# EAGLE design OSO-MISC-20-023 Trinket SWD Adapter (EAGLE 9.6.2)
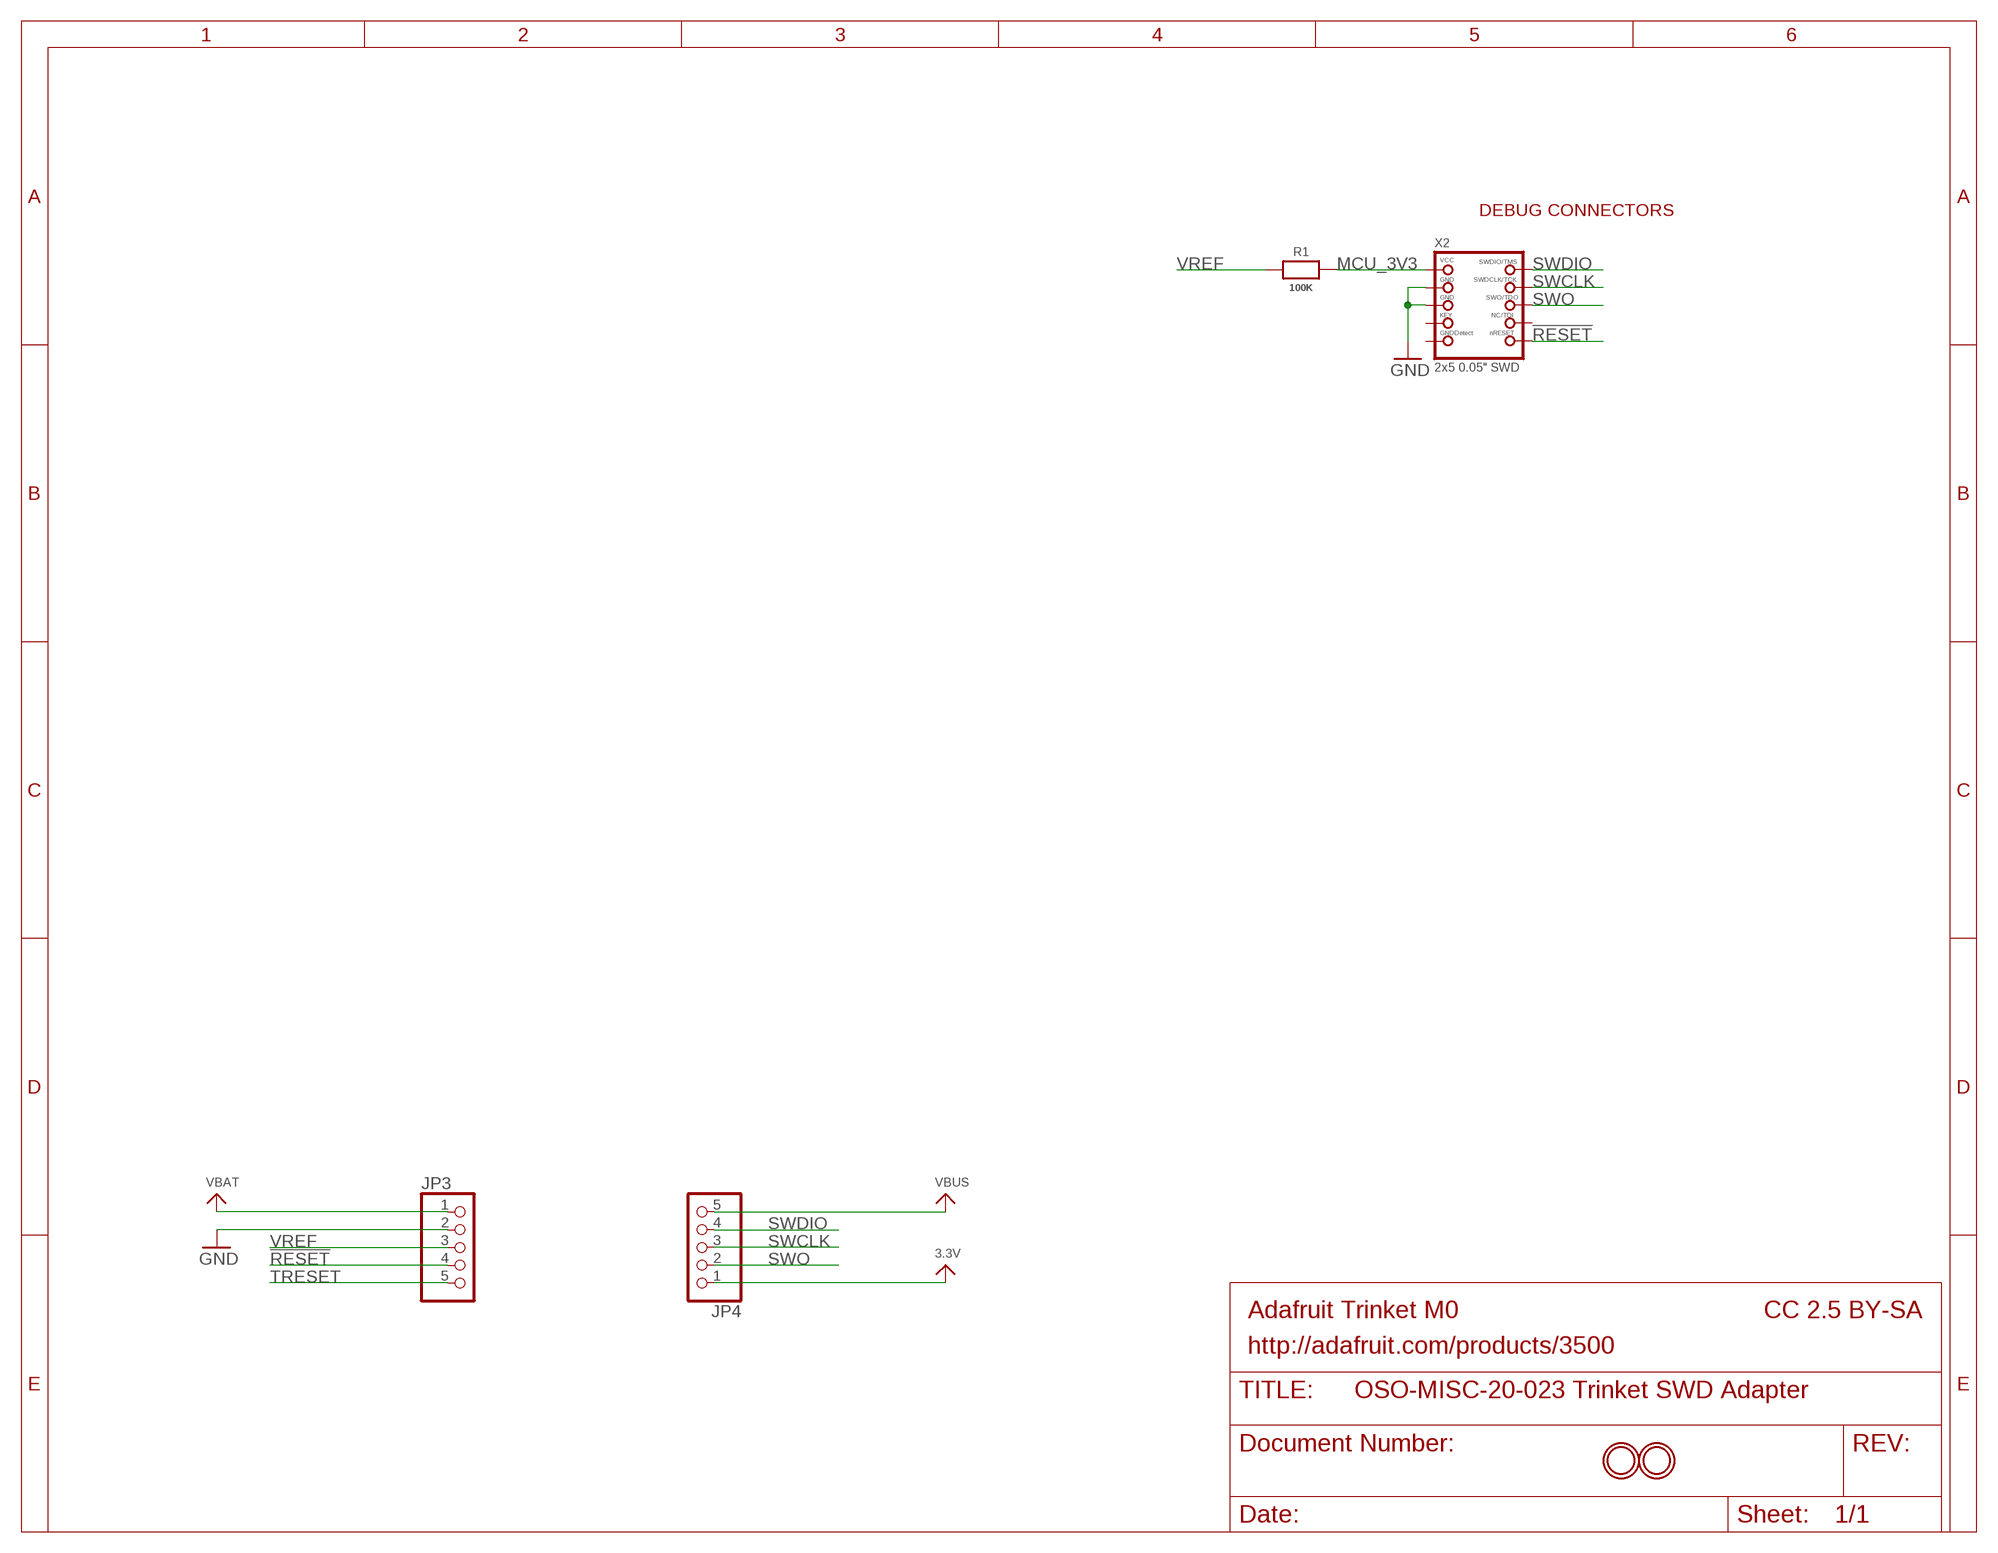
[diagram p0: schematic, sheet 1]

## Parts
JP3  HEADER-1X576MIL  [1X05_ROUND_76]
JP4  HEADER-1X576MIL  [1X05_ROUND_76]
R1  100K  RESISTOR0805_NOOUTLINE  [0805-NO]
U$8  MOUNTINGHOLE2.0  [MOUNTINGHOLE_2.0_PLATED]
U$9  MOUNTINGHOLE2.0  [MOUNTINGHOLE_2.0_PLATED]
X2  2x5 0.05" SWD  JTAG-CORTEXBOXPOSTS  [2X05_1.27MM_BOX_POSTS]

## Nets
3.3V: JP4.1
!RESET: JP3.4 X2.10(NRESET)
GND: JP3.2 X2.3(GND) X2.5(GND)
MCU_3V3 [power]: R1.2 X2.1(VCC)
SWCLK: JP4.3 X2.4(SWDCLK)
SWDIO: JP4.4 X2.2(SWDIO)
SWO: JP4.2 X2.6(SWO)
TRESET: JP3.5
VBAT: JP3.1
VBUS: JP4.5
VREF [power]: JP3.3 R1.1
Unconnected: X2.7(KEY) X2.8(TDI) X2.9(GNDDETECT)

## Notes on the sheet
- DEBUG CONNECTORS
- Adafruit Trinket M0 | CC 2.5 BY-SA
- http://adafruit.com/products/3500

## Library data of the parts
JP3 JP4 = microbuilder:HEADER-1X5: PIN HEADER
R1 = microbuilder:RESISTOR: Resistors For new designs, use the packages preceded by an '_' character since they are more reliable: The following footprints should be used on most boards: _0402 - Standard footprint for regular board layouts _0603 - Standard footprint for regular board layouts _0805 - Standard footprint for regular board layouts _1206 - Standard footprint for regular board layouts For extremely tight-pitch boards where space is at a premium, the following 'micro-pitch' footprints can be used (smaller pads, no silkscreen outline, etc.): _0402MP - Micro-pitch footprint for very dense/compact boards _0603MP - Micro-pitch footprint for very dense/compact boards _0805MP - Micro-pitch footprint for very dense/compact boards _1206MP - Micro-pitch footprint for very dense/compact boards
U$8 U$9 = microbuilder:MOUNTINGHOLE: Mounting Hole For #2 screws (0.086"/2.18mm width, 0.094"/2.4mm hole) use 2.5mm; BOM: EXCLUDE
X2 = microbuilder:JTAG-CORTEX: Serial Wire (SW-DP) Connector Standard 0.05" 10-pin connector is for use with the Cortex M and Cortex A SWD (serial wire debugger) interface (SW-DP) Connectors 2x05_1.27MM_SMT - Inexpensive surface-mount header with bare pins, compatible with standard 10-pin SWD cables (4UCON: 16846) 2x05_1.27MM_BOX_NOPOSTS - Polarised surface-mount box (4UCON with caps: 19735, without caps: 15117 2x05_1.27MM_BOX_POSTS - Polarised surface-mount box with mounting holes (4UCON: 20317) Pinout: http://infocenter.arm.com/help/topic/com.arm.doc.faqs/attached/13634/cortex_debug_connectors.pdf http://www.keil.com/peripherals/coresight/connectors.asp

## Net classes
0 default: width 0.152 mm, drill 0.254 mm
1 power: width 0.305 mm, drill 0.305 mm

## Board
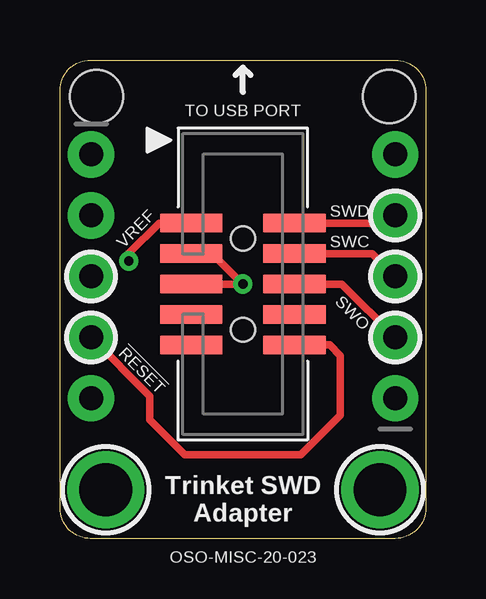
[diagram p1: board, top side]
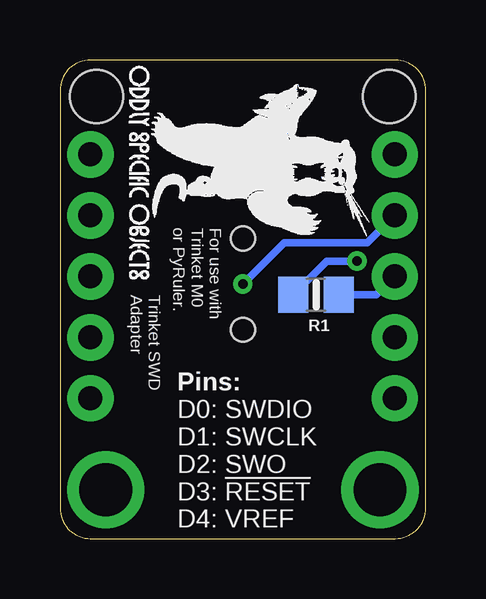
[diagram p2: board, bottom side, seen from below]

Size 15.24 x 19.94 mm. Coordinates in mm from the lower left corner, seen from the top.
Outline: 15.24,18.67 15.24,1.27 arc-90 13.97,0 1.27,0 arc-90 0,1.27 0,18.67 arc-90 1.27,19.94 13.97,19.94 arc-90 15.24,18.67
Copper layers (1*16): Top 0.035mm / dielectric 1.5mm / Bottom 0.035mm
Design rules "adafruit *": minimum track width 8mil, minimum drill 15.5mil, track to track 8mil, track to pad 8mil, pad to pad 8mil, via to via 8mil, smd to smd 8mil, copper to edge 10mil, drill to drill 8mil, minimum pad ring 10mil, minimum via ring 8mil, stop-mask expansion 2mil, vias tented up to drill 20mil, thermal gap 10mil
Holes 2.2 mm at 1.52,18.41 13.72,18.41

### Footprints (pad centres in the part's own frame; a part is rotated, then mirrored left to right if it is on the bottom)
1X05_ROUND_76 = drill 1 pad 1.93: 1 -5.08,0; 2 -2.54,0; 3 0,0; 4 2.54,0; 5 5.08,0
0805-NO = smd 1.24 x 1.5: 1 -0.95,0; 2 0.95,0
MOUNTINGHOLE_2.0_PLATED = drill 2.2 pad 3: P$1 0,0
2X05_1.27MM_BOX_POSTS = smd 0.76 x 2.6: 1 -2.54,-2.15; 2 -2.54,2.15; 3 -1.27,-2.15; 4 -1.27,2.15; 5 0,-2.15; 6 0,2.15; 7 1.27,-2.15; 8 1.27,2.15; 9 2.54,-2.15; 10 2.54,2.15 | hole 1: -1.905,0; 1.905,0

### Placement (x,y rotation side)
JP3  1.3,10.92 270 top
JP4  13.97,10.92 90 top
R1  4.57,10.16 180 bottom
U$1  [OSO_BEAR_250X360MIL_1000DPI]  6.86,15.75 270 bottom
U$2  [OSO_WORDMARK_ONELINE_350MIL_1000DPI]  11.94,15.24 270 bottom
U$8  1.91,2.03 0 top
U$9  13.34,2.03 0 top
X2  7.62,10.6 270 top

### Tracks (layer width: path | path; a pad name or v marks a point on that pad's centre or on a via)
!RESET
  Top 0.305: X2.10 11.24,8.07 11.68,7.62 11.68,5.14 10.03,3.49 5.21,3.49 3.75,4.95 3.75,5.93 JP3.4
GND  (via drill 0.39)
  Top 0.305: X2.5 v7.62,10.61 6.35,11.88 X2.3
  Bottom 0.305: JP3.2 2.44,12.32 5.91,12.32 v7.62,10.61
MCU_3V3  (via drill 0.39)
  Top 0.305: v2.86,11.56 2.86,11.88 4.13,13.14 X2.1
  Bottom 0.305: R1.2 4.12,11.56 v2.86,11.56
SWCLK
  Top 0.305: X2.4 13.02,11.88 JP4.3
SWDIO
  Top 0.305: X2.2 13.65,13.14 JP4.4
SWO
  Top 0.305: X2.6 11.75,10.61 JP4.2
VREF
  Bottom 0.305: R1.1 2.06,10.16 JP3.3

### Text on the board
tPlace: TO USB PORT | SWD | VREF | SWC | SWO | !RESET | Trinket SWD / Adapter | OSO-MISC-20-023
bPlace: For use with / Trinket M0 / or PyRuler. | Trinket SWD / Adapter | D0: SWDIO / D1: SWCLK / D2: SWO / D3: !RESET / D4: VREF | Pins:
tDocu: D0/A4/SDA | D4/A2/RXD/MOSI | D1/A0/VOUT | D3/A3/TXD/SCK | D2/A1/SCL/MISO